# Altium schematic sheet Psyduck.SchDoc
size A
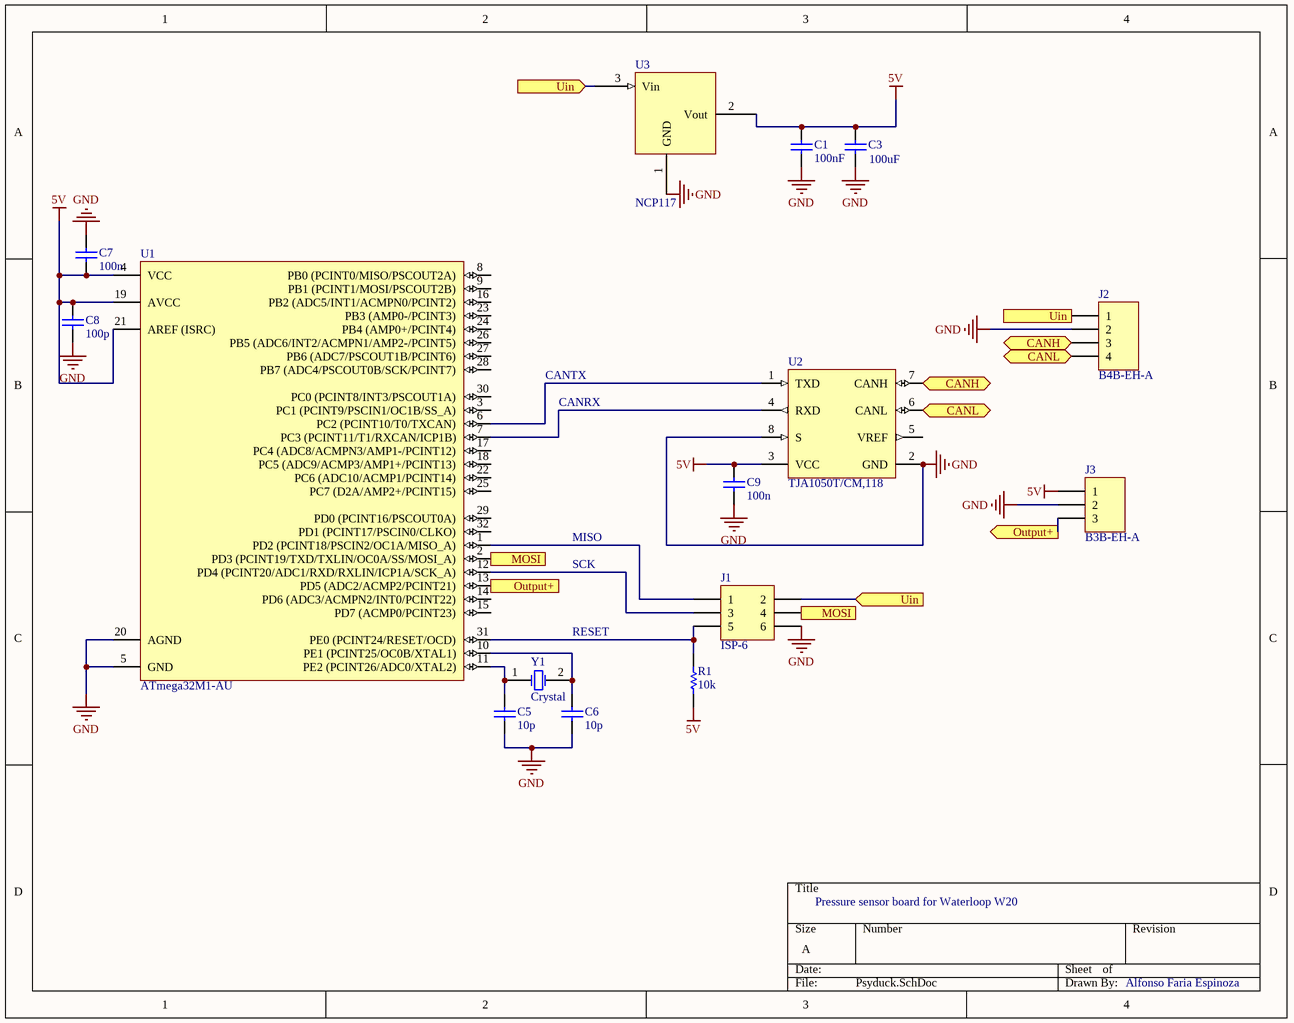
[diagram p0: Psyduck.SchDoc]

## Parts
C1  100nF  [CAPC2013X88X50NL20T25]
C3  value 100uF  [C1210]
C5  10p  [CAPC2013X88X50NL20T25]
C6  10p  [CAPC2013X88X50NL20T25]
C7  100n  [CAPC2013X88X50NL20T25]
C8  100p  [CAPC2013X88X50NL20T25]
C9  100n  [CAPC2013X88X50NL20T25]
J1  ISP-6  [HDR2X3]
J2  B4B-EH-A  [MHDR1X4]
J3  B3B-EH-A  [MHDR1X3]
R1  10k  [RESC0805(2012)_M]
U1  ATmega32M1-AU  [32A_M]
U2  TJA1050T/CM,118  [NXP-SOT96-1_M]
U3  NCP117  [MCP1799]
Y1  Crystal  [XRCHA16M000F0A01R0]

## Ports
CANH (bidir), CANL (bidir), MOSI (in), MOSI (out), Output+ (in), Output+ (out), Uin (in), Uin (out)

## Nets
5V: C1.2 C3.2 C7.1 C8.2 C9.2 J3.1 R1.1 U1.4(VCC) U1.19(AVCC) U1.21(AREF_(ISRC)) U2.3(VCC) U3.2(Vout)
GND: C1.1 C3.1 C5.1 C6.1 C7.2 C8.1 C9.1 J1.6 J2.2 J3.2 U1.5(GND) U1.20(AGND) U2.2(GND) U2.8(S) U3.1(GND)
CANH: J2.3 U2.7(CANH) ; port CANH
CANL: J2.4 U2.6(CANL) ; port CANL
MOSI: J1.4 U1.2(PD3_(PCINT19/TXD/TXLIN/OC0A/SS/MOSI_A)) ; port MOSI
Output+: J3.3 U1.13(PD5_(ADC2/ACMP2/PCINT21)) ; port Output+
Uin: J1.2 J2.1 U3.3(Vin) ; port Uin
NetC5_2: C5.2 U1.11(PE2_(PCINT26/ADC0/XTAL2)) Y1.1(OSC1)
NetC6_2: C6.2 U1.10(PE1_(PCINT25/OC0B/XTAL1)) Y1.2(OSC2)
NetJ1_1: J1.1 U1.1(PD2_(PCINT18/PSCIN2/OC1A/MISO_A))
NetJ1_3: J1.3 U1.12(PD4_(PCINT20/ADC1/RXD/RXLIN/ICP1A/SCK_A))
NetJ1_5: J1.5 R1.2 U1.31(PE0_(PCINT24/RESET/OCD))
NetU1_6: U1.6(PC2_(PCINT10/T0/TXCAN)) U2.1(TXD)
NetU1_7: U1.7(PC3_(PCINT11/T1/RXCAN/ICP1B)) U2.4(RXD)

Not connected (* = marked no-connect by the designer): U1 3(PC1_(PCINT9/PSCIN1/OC1B/SS_A)) 8(PB0_(PCINT0/MISO/PSCOUT2A)) 9(PB1_(PCINT1/MOSI/PSCOUT2B)) 14(PD6_(ADC3/ACMPN2/INT0/PCINT22)) 15(PD7_(ACMP0/PCINT23)) 16(PB2_(ADC5/INT1/ACMPN0/PCINT2)) 17(PC4_(ADC8/ACMPN3/AMP1-/PCINT12)) 18(PC5_(ADC9/ACMP3/AMP1+/PCINT13)) 22(PC6_(ADC10/ACMP1/PCINT14)) 23(PB3_(AMP0-/PCINT3)) 24(PB4_(AMP0+/PCINT4)) 25(PC7_(D2A/AMP2+/PCINT15)) 26(PB5_(ADC6/INT2/ACMPN1/AMP2-/PCINT5)) 27(PB6_(ADC7/PSCOUT1B/PCINT6)) 28(PB7_(ADC4/PSCOUT0B/SCK/PCINT7)) 29(PD0_(PCINT16/PSCOUT0A)) 30(PC0_(PCINT8/INT3/PSCOUT1A)) 32(PD1_(PCINT17/PSCIN0/CLKO)); U2 5(VREF)

## Notes on the sheet
- CANTX
- CANRX
- MISO
- SCK
- RESET
- Pressure sensor board for Waterloop W20
- Alfonso Faria Espinoza

## Library data of the parts
C1 C5-C9 = CMP-2007-00279-1: Part Number: CL21B104JBCNNNC; Manufacturer: Samsung
C3 = Cap Semi: Capacitor (Semiconductor SIM Model); Published: 8-Jun-2000; LatestRevisionDate: 29-May-2009; LatestRevisionNote: IPC-7351 Footprint Added.; PackageReference: C1206; Publisher: Altium Limited; PackageDescription: Chip Capacitor
J1 = Header 3X2: Header, 3-Pin, Dual row; LatestRevisionDate: 17-Jul-2002; LatestRevisionNote: Re-released for DXP Platform.; Publisher: Altium Limited
J2 = MHDR1X4: Header, 4-Pin; LatestRevisionDate: 17-Jul-2002; LatestRevisionNote: Re-released for DXP Platform.; Publisher: Altium Limited
J3 = MHDR1X3: Header, 3-Pin; LatestRevisionDate: 17-Jul-2002; LatestRevisionNote: Re-released for DXP Platform.; Publisher: Altium Limited
R1 = CMP-1013-00528-1: Value: 10000.00 Ohm; Case-Metric: 2012; Case-EIA: 0805; Technology: SMT
U1 = CMP-0096-00150-2: 8-bit AVR Microcontroller, 2.7-5.5V, 16MHz, 32KB Flash, 1KB EEPROM, 2KB SRAM, Industrial Grade (-40° to +85°C), 32-Pin TQFP; ComponentLink1URL: http://www.atmel.com/; PackageDescription: 32-Lead, 7x7x1.0 mm Body, 0.8mm Lead Pitch, Thin Profile Plastic Quad Flat Package (TQFP); Code_JEDEC: MS-026-ABA; ComponentLink3URL: http://www.atmel.com/dyn/resources/prod_documents/8209S.pdf; ComponentLink2Description: ATmega16M1/32M1/64M1 Datasheet; ComponentLink2URL: http://www.atmel.com/dyn/resources/prod_documents/doc8209.pdf; PackageReference: 32A; RevisionNote: DatasheetVersion & PackageVersion updated. URLs added.; DatasheetVersion: revD, Nov-2010; ComponentLink3Description: ATmega16M1/32M1/64M1 Summary; PackageVersion: revC, Oct-2010; ComponentLink1Description: Manufacturer URL
U2 = CMP-2000-04923-1: High speed CAN transceiver, 4.75 to 5.25 V, -40 to 150 degC, 8-Pin SO (SOT96-1), RoHS, Tape and Reel; Manufacturer: NXP Semiconductors; Duplex: Half; Number of Drivers/Receivers: 1/1; Product Training Modules: CANandLINBusTransceiver; Receiver Hysteresis: 70mV; Voltage - Supply: 4.75V~5.25V; Dynamic Catalog: CANTransceivers; Other Names: 568-10292-1; PCN Packaging: LighterPackingReels30/Mar/2014; PCN Obsolescence: TJA105028/Apr/2013 / MultipleDevices19/Apr/2013; Standard Package: 1; Family: Interface-Drivers,Receivers,Transceivers; Package Reference: SOT96-1; Mounting Type: SurfaceMount; Package / Case: 8-SOIC(0.154",3.90mmWidth); Package Description: 8-Pin Small Outline Integrated Circuit, Body 4.9 x 3.9 mm, Pitch 1.27 mm; Protocol: CAN; Package/Case: 8-SOIC(0.154",3.90mmWidth); Supplier Device Package: 8-SO; <PCN>: http://media.digikey.com/pdf/PCNs/NXP/201209019F04_TJA1050_Obs.pdf; Minimum Quantity: Transceiver; Datasheet URL: http://www.nxp.com/documents/data_sheet/TJA1050.pdf; Category: IntegratedCircuits(ICs); Quantity Available: CutTape(CT)AlternatePackaging; Datasheet Version: Rev. 4, 10/2003; Type: Transceiver; Packaging: CutTape(CT); Manufacturer URL: http://www.nxp.com/
Y1 = XTAL: Crystal Oscillator; Published: 8-Jun-2000; LatestRevisionDate: 17-Jul-2002; LatestRevisionNote: Re-released for DXP Platform.; PackageReference: R38; Publisher: Altium Limited; PackageDescription: Crystal, Thru-Hole; 2 Leads; Body 3.1 x 8.2 mm (Dia.xH)